# EAGLE design Board1 (EAGLE 9.5.1)
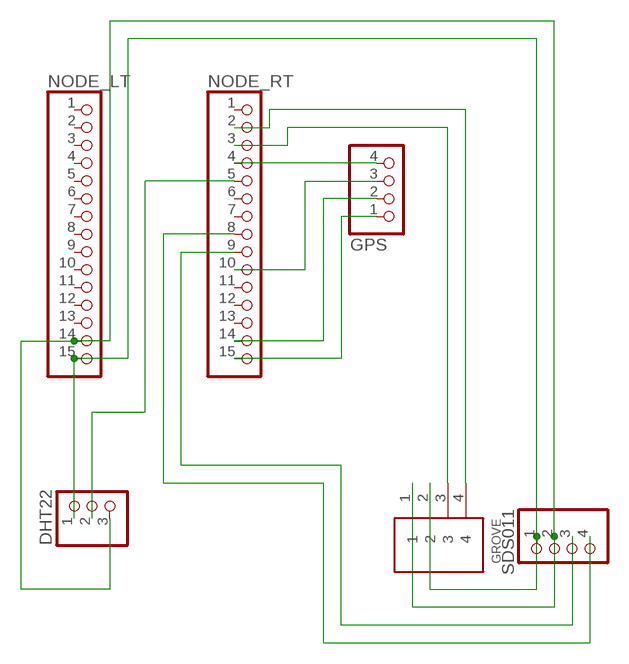
[diagram p0: schematic, sheet 1]

## Parts
DHT22  PINHD-1X3  [1X03]
GPS  PINHD-1X4  [1X04]
GROVE  4PIN  [B4B-PH-K-S]
NODE_LT  PINHD-1X15  [1X15]
NODE_RT  PINHD-1X15  [1X15]
SDS011  PINHD-1X4  [1X04]

## Nets
N$1: DHT22.1 GROVE.2 NODE_LT.15 SDS011.1
N$2: DHT22.3 GROVE.1 NODE_LT.14 SDS011.2
N$3: GPS.4 NODE_RT.4
N$4: GPS.3 NODE_RT.10
N$5: DHT22.2 NODE_RT.5
N$6: NODE_RT.9 SDS011.3
N$7: GPS.2 NODE_RT.14
N$8: GROVE.3 NODE_RT.3
N$9: GROVE.4 NODE_RT.2
N$10: GPS.1 NODE_RT.15
N$11: NODE_RT.8 SDS011.4
Unconnected: NODE_LT.1 NODE_LT.2 NODE_LT.3 NODE_LT.4 NODE_LT.5 NODE_LT.6 NODE_LT.7 NODE_LT.8 NODE_LT.9 NODE_LT.10 NODE_LT.11 NODE_LT.12 NODE_LT.13 NODE_RT.1 NODE_RT.6 NODE_RT.7 NODE_RT.11 NODE_RT.12 NODE_RT.13

## Library data of the parts
DHT22 = pinhead:PINHD-1X3: PIN HEADER
GPS SDS011 = pinhead:PINHD-1X4: PIN HEADER
GROVE = jst_eph:4PIN
NODE_LT NODE_RT = pinhead:PINHD-1X15: PIN HEADER

## Board
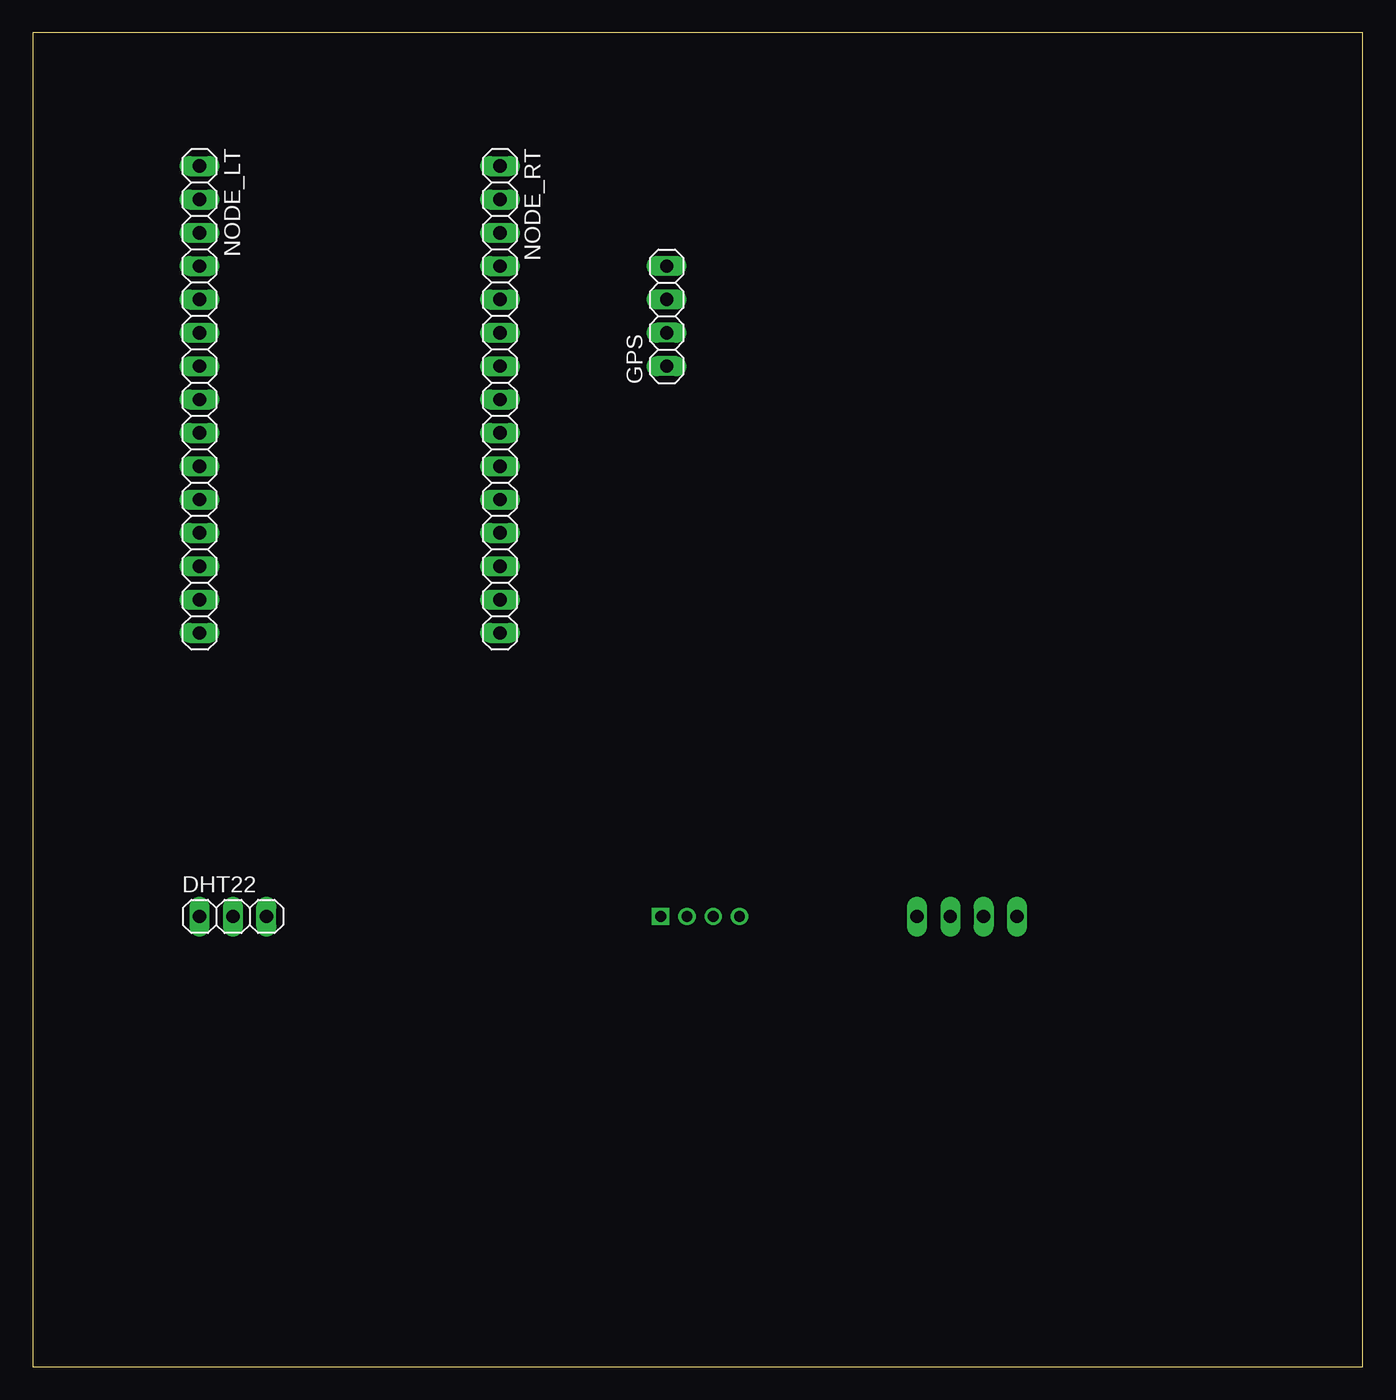
[diagram p1: board, top side]
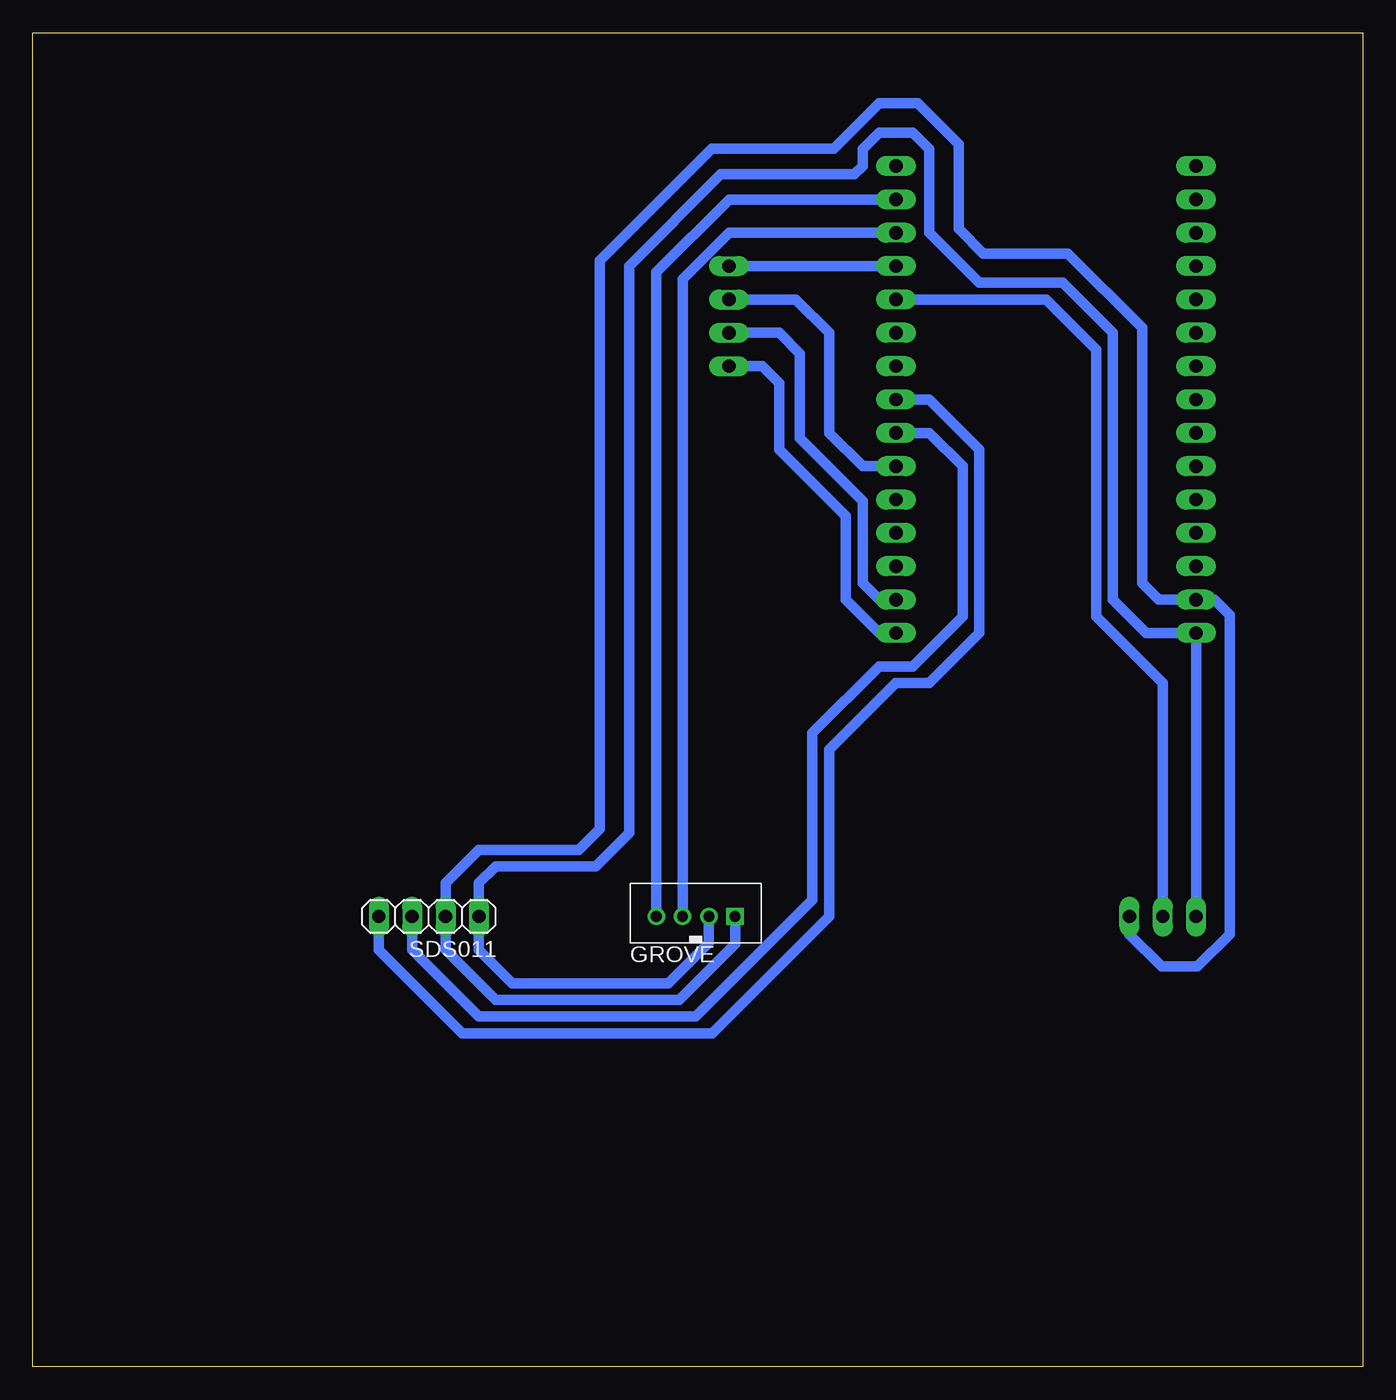
[diagram p2: board, bottom side, seen from below]

Size 101.27 x 101.59 mm. Coordinates in mm from the lower left corner, seen from the top.
Outline: 0,0 101.27,0 101.27,101.59 0,101.59 0,0
Copper layers (1*16): Top 0.035mm / dielectric 1.5mm / Bottom 0.035mm
Design rules "default": minimum track width 6mil, minimum drill 0.35mm, track to track 6mil, track to pad 6mil, pad to pad 6mil, via to via 6mil, smd to smd 6mil, copper to edge 40mil, drill to drill 6mil, minimum pad ring 10mil, minimum via ring 8mil, stop-mask expansion 4mil, vias tented up to drill 0mil, thermal gap 10mil

### Footprints (pad centres in the part's own frame; a part is rotated, then mirrored left to right if it is on the bottom)
1X03 = drill 1.016 long: 1 -2.54,0; 2 0,0; 3 2.54,0
1X04 = drill 1.016 long: 1 -3.81,0; 2 -1.27,0; 3 1.27,0; 4 3.81,0
B4B-PH-K-S = drill 0.813 square: 1 3,0 | drill 0.813: 2 1,0; 3 -1,0; 4 -3,0
1X15 = drill 1.016 long: 1 -17.78,0; 2 -15.24,0; 3 -12.7,0; 4 -10.16,0; 5 -7.62,0; 6 -5.08,0; 7 -2.54,0; 8 0,0; 9 2.54,0; 10 5.08,0; 11 7.62,0; 12 10.16,0; 13 12.7,0; 14 15.24,0; 15 17.78,0

### Placement (x,y rotation side)
DHT22  15.24,34.29 0 top
GPS  48.26,80.01 90 top
GROVE  50.8,34.29 0 bottom
NODE_LT  12.7,73.66 270 top
NODE_RT  35.56,73.66 270 top
SDS011  71.12,34.29 180 bottom

### Tracks (layer width: path | path; a pad name or v marks a point on that pad's centre or on a via)
N$1
  Bottom 0.813: DHT22.1 NODE_LT.15 16.51,55.88 19.05,58.42 19.05,78.74 22.86,82.55 29.21,82.55 33.02,86.36 33.02,92.71 34.29,93.98 36.83,93.98 38.1,92.71 38.1,91.44 38.73,90.81 48.9,90.81 55.88,83.82 55.88,40.64 58.42,38.1 66.04,38.1 67.31,36.83 SDS011.1 67.31,31.75 64.77,29.21 52.88,29.21 49.8,32.29 GROVE.2
N$2
  Bottom 0.813: 69.85,34.2 SDS011.2 | SDS011.2 69.85,31.75 66.04,27.94 52.07,27.94 47.8,32.21 GROVE.1 47.8,33.83 | SDS011.2 69.85,36.83 67.31,39.37 59.69,39.37 58.12,40.95 58.12,84.22 49.58,92.76 40.29,92.76 36.83,96.22 33.89,96.22 30.79,93.11 30.79,86.67 28.91,84.78 22.46,84.78 16.82,79.14 16.82,59.69 15.54,58.42 NODE_LT.14 11.34,58.42 10.16,57.24 10.16,32.93 12.61,30.48 15.33,30.48 17.78,32.93 DHT22.3
N$3
  Bottom 0.813: GPS.4 NODE_RT.4
N$4
  Bottom 0.813: GPS.3 43.18,81.28 40.64,78.74 40.64,71.12 38.1,68.58 NODE_RT.10
N$5
  Bottom 0.813: DHT22.2 15.24,52.07 20.32,57.15 20.32,77.47 24.13,81.28 NODE_RT.5
N$6
  Bottom 0.813: NODE_RT.9 33.02,71.12 30.48,68.58 30.48,57.15 34.29,53.34 36.83,53.34 41.91,48.26 41.91,35.56 50.8,26.67 67.31,26.67 72.39,31.75 SDS011.3
N$7
  Bottom 0.813: GPS.2 44.45,78.74 42.88,77.17 42.88,70.72 38.1,65.94 38.1,59.69 36.83,58.42 NODE_RT.14
N$8
  Bottom 0.813: GROVE.3 51.8,82.82 48.26,86.36 NODE_RT.3
N$9
  Bottom 0.813: GROVE.4 53.8,83.36 48.26,88.9 NODE_RT.2
N$10
  Bottom 0.813: NODE_RT.15 36.83,55.88 39.37,58.42 39.37,64.77 44.45,69.85 44.45,74.93 45.72,76.2 GPS.1
N$11
  Bottom 0.813: NODE_RT.8 33.02,73.66 29.21,69.85 29.21,55.88 33.02,52.07 35.56,52.07 40.64,46.99 40.64,34.29 49.53,25.4 68.58,25.4 74.93,31.75 SDS011.4